# Altium schematic sheet mainpcb.SchDoc
size A4; SheetNumber: 4; SheetTotal: 5
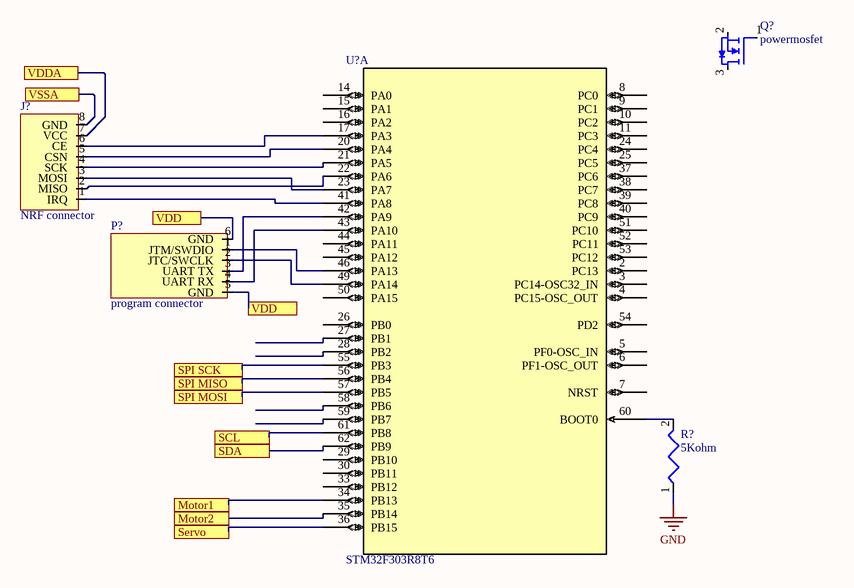
[diagram p0: mainpcb.SchDoc]

## Parts
J?  NRF connector  [8 pin RF]
P?  program connector  [M20-9980345]
Q?  powermosfet  [SI2336DS-T1-GE3 - duplicate]
R?  5Kohm  [ERJ-2RK]
U?  STM32F303R8T6  [LQFP64-10x10mm]  (part A of 2)

## Ports
Motor1, Motor2, SCL, SDA, Servo, SPI MISO, SPI MOSI, SPI SCK, VDD, VDDA, VSSA

## Nets
GND: R?.1
Motor1: U?.34(PB13) ; port Motor1
Motor2: U?.35(PB14) ; port Motor2
SCL: U?.61(PB8) ; port SCL
SDA: U?.62(PB9) ; port SDA
Servo: U?.36(PB15) ; port Servo
SPI MISO: U?.56(PB4) ; port SPI MISO
SPI MOSI: U?.57(PB5) ; port SPI MOSI
SPI SCK: U?.55(PB3) ; port SPI SCK
VDD: P?.5(GND) P?.6(GND) ; port VDD
VDDA: J?.7(VCC) ; port VDDA
VSSA: J?.8(GND) ; port VSSA
NetJ?_1: J?.1(IRQ) U?.41(PA8)
NetJ?_2: J?.2(MISO) U?.22(PA6)
NetJ?_3: J?.3(MOSI) U?.23(PA7)
NetJ?_4: J?.4(SCK) U?.21(PA5)
NetJ?_5: J?.5(CSN) U?.20(PA4)
NetJ?_6: J?.6(CE) U?.17(PA3)
NetP?_1: P?.1(JTM/SWDIO) U?.46(PA13)
NetP?_2: P?.2(JTC/SWCLK) U?.49(PA14)
NetP?_3: P?.3(UART_TX) U?.42(PA9)
NetP?_4: P?.4(UART_RX) U?.43(PA10)
NetR?_2: R?.2 U?.60(BOOT0)

Not connected (* = marked no-connect by the designer): Q? 1(G) 2(S) 3(D); U? 2(PC13) 3(PC14-OSC32_IN) 4(PC15-OSC_OUT) 5(PF0-OSC_IN) 6(PF1-OSC_OUT) 7(NRST) 8(PC0) 9(PC1) 10(PC2) 11(PC3) 14(PA0) 15(PA1) 16(PA2) 24(PC4) 25(PC5) 26(PB0) 27(PB1) 28(PB2) 29(PB10) 30(PB11) 33(PB12) 37(PC6) 38(PC7) 39(PC8) 40(PC9) 44(PA11) 45(PA12) 50(PA15) 51(PC10) 52(PC11) 53(PC12) 54(PD2) 58(PB6) 59(PB7)

## Library data of the parts
J? = 8 pin NRF
P? = M20-9980345: HARWIN - M20-9980345 - Board-To-Board Connector, Vertical, 2.54 mm, 6 Contacts, Header, M20 Series, Through Hole, 2 Rows; Number of Contacts: 6; Max Current Rating: 3A; Contact Resistance: 25mR; Gender: Male; Insulation Resistance: 10GR; Connector Type: Male Pin; Pitch: 2.54mm; Row Spacing: 0.1inch; Supplier 1: Digi-Key; Manufacturer: Harwin; Manufacturer Part Number: M20-9980345; RoHS: Yes; Category: Headers and Wire Housings; Stock 1: 24477; Pricing 1: 1=0.29000, 10=0.27300, 100=0.19110, 500=0.16380, 1000=0.13650, 5000=0.11700, 10000=0.10920 (USD); Mount: Through Hole; Contact Plating: Gold; Contact Material: Brass,Bronze; Color: Black; Weight: 0.125lb; Housing Color: Black; Housing Material: Nylon; Insulation Material: Polyester; Min Operating Temperature: -40°C; Max Operating Temperature: 105°C; Number of Rows: 2; Termination: Solder; Package Quantity: 1000; Current Rating: 3A; Packaging: Bag; Number of Positions: 6; Orientation: Straight; Series: M20; Contact Type: Male Pin; Length: 7.62mm; Width: 0.25inch; Height: 0.125inch; Contact Mating Length: 0.24inch; Depth: 5.08mm; Radiation Hardening: No; REACH SVHC: No SVHC; RoHS Compliant: Yes; ComponentLink1URL: https://datasheet.ciiva.com/6789/91635-6789923.pdf?src-supplier=Newark; ComponentLink1Description: https://datasheet.ciiva.com/6789/91635-6789923.pdf?src-supplier=Newark; ComponentLink2URL: https://datasheet.ciiva.com/11746/0900766b80da602b-11746662.pdf?src-supplier=RSComponents; ComponentLink2Description: https://datasheet.ciiva.com/11746/0900766b80da602b-11746662.pdf?src-supplier=RSComponents; ComponentLink3URL: https://datasheet.ciiva.com/26852/getdatasheetpartid-420465-26852189.pdf?src-supplier=Verical; ComponentLink3Description: https://datasheet.ciiva.com/26852/getdatasheetpartid-420465-26852189.pdf?src-supplier=Verical; ComponentLink4URL: https://datasheet.ciiva.com/6830/m20-998-6830775.pdf?src-supplier=Digi-Key; ComponentLink4Description: https://datasheet.ciiva.com/6830/m20-998-6830775.pdf?src-supplier=Digi-Key; ComponentLink5URL: https://datasheet.ciiva.com/8046/112195-8046904.pdf?src-supplier=Element14; ComponentLink5Description: https://datasheet.ciiva.com/8046/112195-8046904.pdf?src-supplier=Element14; Supplier Part Number 1: 952-2120-ND
Q? = SI2336DS-T1-GE3: MOSFET N-CH 30V 5.2A SOT-23; Manufacturer: Vishay Siliconix; Rds On Max: 42mR; Input Capacitance: 560pF; Gate to Source Voltage (Vgs): 8V; Element Configuration: Single; Max Power Dissipation: 1.8W; Number of Elements: 1; Power Dissipation: 1.25W; Rise Time: 10ns; Nominal Vgs: 400mV; Turn-Off Delay Time: 20ns; Turn-On Delay Time: 6ns; Polarity: N-CHANNEL; Supplier 1: Farnell; Manufacturer Part Number: SI2336DS-T1-GE3; RoHS: Yes; Category: MOSFETs; Stock 1: 10813; Pricing 1: 1=0.51400, 10=0.35200, 100=0.26600, 500=0.21000, 1000=0.18300, 5000=0.15400 (EUR); Mount: Surface Mount; Case/Package: SOT-23; Number of Pins: 3; Weight: 0.050717oz; Min Operating Temperature: -55°C; Max Operating Temperature: 150°C; Packaging: Tape and Reel; Package Quantity: 1; Continuous Drain Current (ID): 5.2A; Drain to Source Voltage (Vdss): 30V; Drain to Source Resistance: 42mR; Fall Time: 10ns; Threshold Voltage: 400mV; Number of Channels: 1; Series: TrenchFET®; REACH SVHC: No SVHC; Lead Free: Lead Free; RoHS Compliant: Yes; ComponentLink1URL: https://datasheet.ciiva.com/11160/si2336ds-11160912.pdf?src-supplier=Avnet; ComponentLink1Description: https://datasheet.ciiva.com/11160/si2336ds-11160912.pdf?src-supplier=Avnet; ComponentLink2URL: https://datasheet.ciiva.com/4440/si2336ds-260499-4440346.pdf?src-supplier=Mouser; ComponentLink2Description: https://datasheet.ciiva.com/4440/si2336ds-260499-4440346.pdf?src-supplier=Mouser; ComponentLink3URL: https://datasheet.ciiva.com/22697/1915678-22697818.pdf?src-supplier=Element14; ComponentLink3Description: https://datasheet.ciiva.com/22697/1915678-22697818.pdf?src-supplier=Element14; ComponentLink4URL: https://datasheet.ciiva.com/6373/si2336ds-6373839.pdf?src-supplier=Digi-Key; ComponentLink4Description: https://datasheet.ciiva.com/6373/si2336ds-6373839.pdf?src-supplier=Digi-Key; ComponentLink5URL: https://datasheet.ciiva.com/7788/si2336ds-7788767.pdf?src-supplier=Element14; ComponentLink5Description: https://datasheet.ciiva.com/7788/si2336ds-7788767.pdf?src-supplier=Element14; ComponentLink6URL: https://datasheet.ciiva.com/6373/si2336ds-6373836.pdf?src-supplier=Digi-Key; ComponentLink6Description: https://datasheet.ciiva.com/6373/si2336ds-6373836.pdf?src-supplier=Digi-Key; ComponentLink7URL: https://datasheet.ciiva.com/6376/si2336ds-6376271.pdf?src-supplier=Digi-Key; ComponentLink7Description: https://datasheet.ciiva.com/6376/si2336ds-6376271.pdf?src-supplier=Digi-Key; Supplier Part Number 1: 1858945
R? = ERJ-2RKF4991X: Res Thick Film 0402 4.99K Ohm 1% 1/10W +/-100ppm/ßC Molded SMD Punched Carrier T/R; Manufacturer: Panasonic; Resistance: 4.99kR; Power Rating: 100mW; Voltage Rating: 50V; Temperature Coefficient: 100ppm/°C; Supplier 1: Farnell; Manufacturer Part Number: ERJ-2RKF4991X; RoHS: Yes; Category: Chip SMD Resistors; Stock 1: 164767; Pricing 1: 10=0.01960, 100=0.00930, 500=0.00630, 2500=0.00570, 5000=0.00530, 10000=0.00490, 50000=0.00440 (EUR); Mount: Surface Mount; Case/Package: 0402; Case Code (Metric): 1005; Case Code (Imperial): 0402; Weight: 2.8E-05oz; Contact Plating: Tin; Min Operating Temperature: -55°C; Max Operating Temperature: 155°C; Tolerance: 1%; Packaging: Tape and Reel; Package Quantity: 1; Resistor Type: Thick Film; Number of Terminations: 2; Termination: SMD/SMT; Max Power Dissipation: 100mW; Voltage Rating (DC): 50V; Working Voltage: 50V; Features: Automotive AEC-Q200; Series: ERJ; Resistance Tolerance: 1%; Technology: THICK FILM; Construction: Rectangular; Length: 1mm; Width: 0.02inch; Height: 0.016inch; Depth: 0.5mm; Radiation Hardening: No; REACH SVHC: No SVHC; Military Standard: Not; Lead Free: Lead Free; RoHS Compliant: Yes; ComponentLink1URL: https://datasheet.ciiva.com/16773/70260748-16773110.pdf?src-supplier=Allied+Electronics; ComponentLink1Description: https://datasheet.ciiva.com/16773/70260748-16773110.pdf?src-supplier=Allied+Electronics; ComponentLink2URL: https://datasheet.ciiva.com/22749/1678782-22749654.pdf?src-supplier=Element14; ComponentLink2Description: https://datasheet.ciiva.com/22749/1678782-22749654.pdf?src-supplier=Element14; ComponentLink3URL: https://datasheet.ciiva.com/24158/aoa0000ce2-24158871.pdf?src-supplier=Mouser; ComponentLink3Description: https://datasheet.ciiva.com/24158/aoa0000ce2-24158871.pdf?src-supplier=Mouser; ComponentLink4URL: https://datasheet.ciiva.com/46388/426256-46388311.pdf?src-supplier=Element14; ComponentLink4Description: https://datasheet.ciiva.com/46388/426256-46388311.pdf?src-supplier=Element14; ComponentLink5URL: https://datasheet.ciiva.com/16199/aoa0000ce2-16199546.pdf?src-supplier=Future+Electronics; ComponentLink5Description: https://datasheet.ciiva.com/16199/aoa0000ce2-16199546.pdf?src-supplier=Future+Electronics; ComponentLink6URL: https://datasheet.ciiva.com/16775/70260748-16775018.pdf?src-supplier=Allied+Electronics; ComponentLink6Description: https://datasheet.ciiva.com/16775/70260748-16775018.pdf?src-supplier=Allied+Electronics; ComponentLink7URL: https://datasheet.ciiva.com/46376/426256-46376955.pdf?src-supplier=Element14; ComponentLink7Description: https://datasheet.ciiva.com/46376/426256-46376955.pdf?src-supplier=Element14; ComponentLink8URL: https://datasheet.ciiva.com/48530/aoa0000ce2-48530971.pdf?src-supplier=Avnet; ComponentLink8Description: https://datasheet.ciiva.com/48530/aoa0000ce2-48530971.pdf?src-supplier=Avnet; Supplier Part Number 1: 2059145
U? = STM32F303R8T6: No Description Available; Vendor: STMicroelectronics; Built_By: EMA_UL_Team; SourceLibrary: Updates_to_database_2020-10-19; Manufacturer_Part_Number: STM32F303R8T6; Copyright: Copyright (C) 2018 Accelerated Designs. All rights reserved; RefDes: RefDes; Type: DEV